# EAGLE design shield-shield (EAGLE 6.5.0)
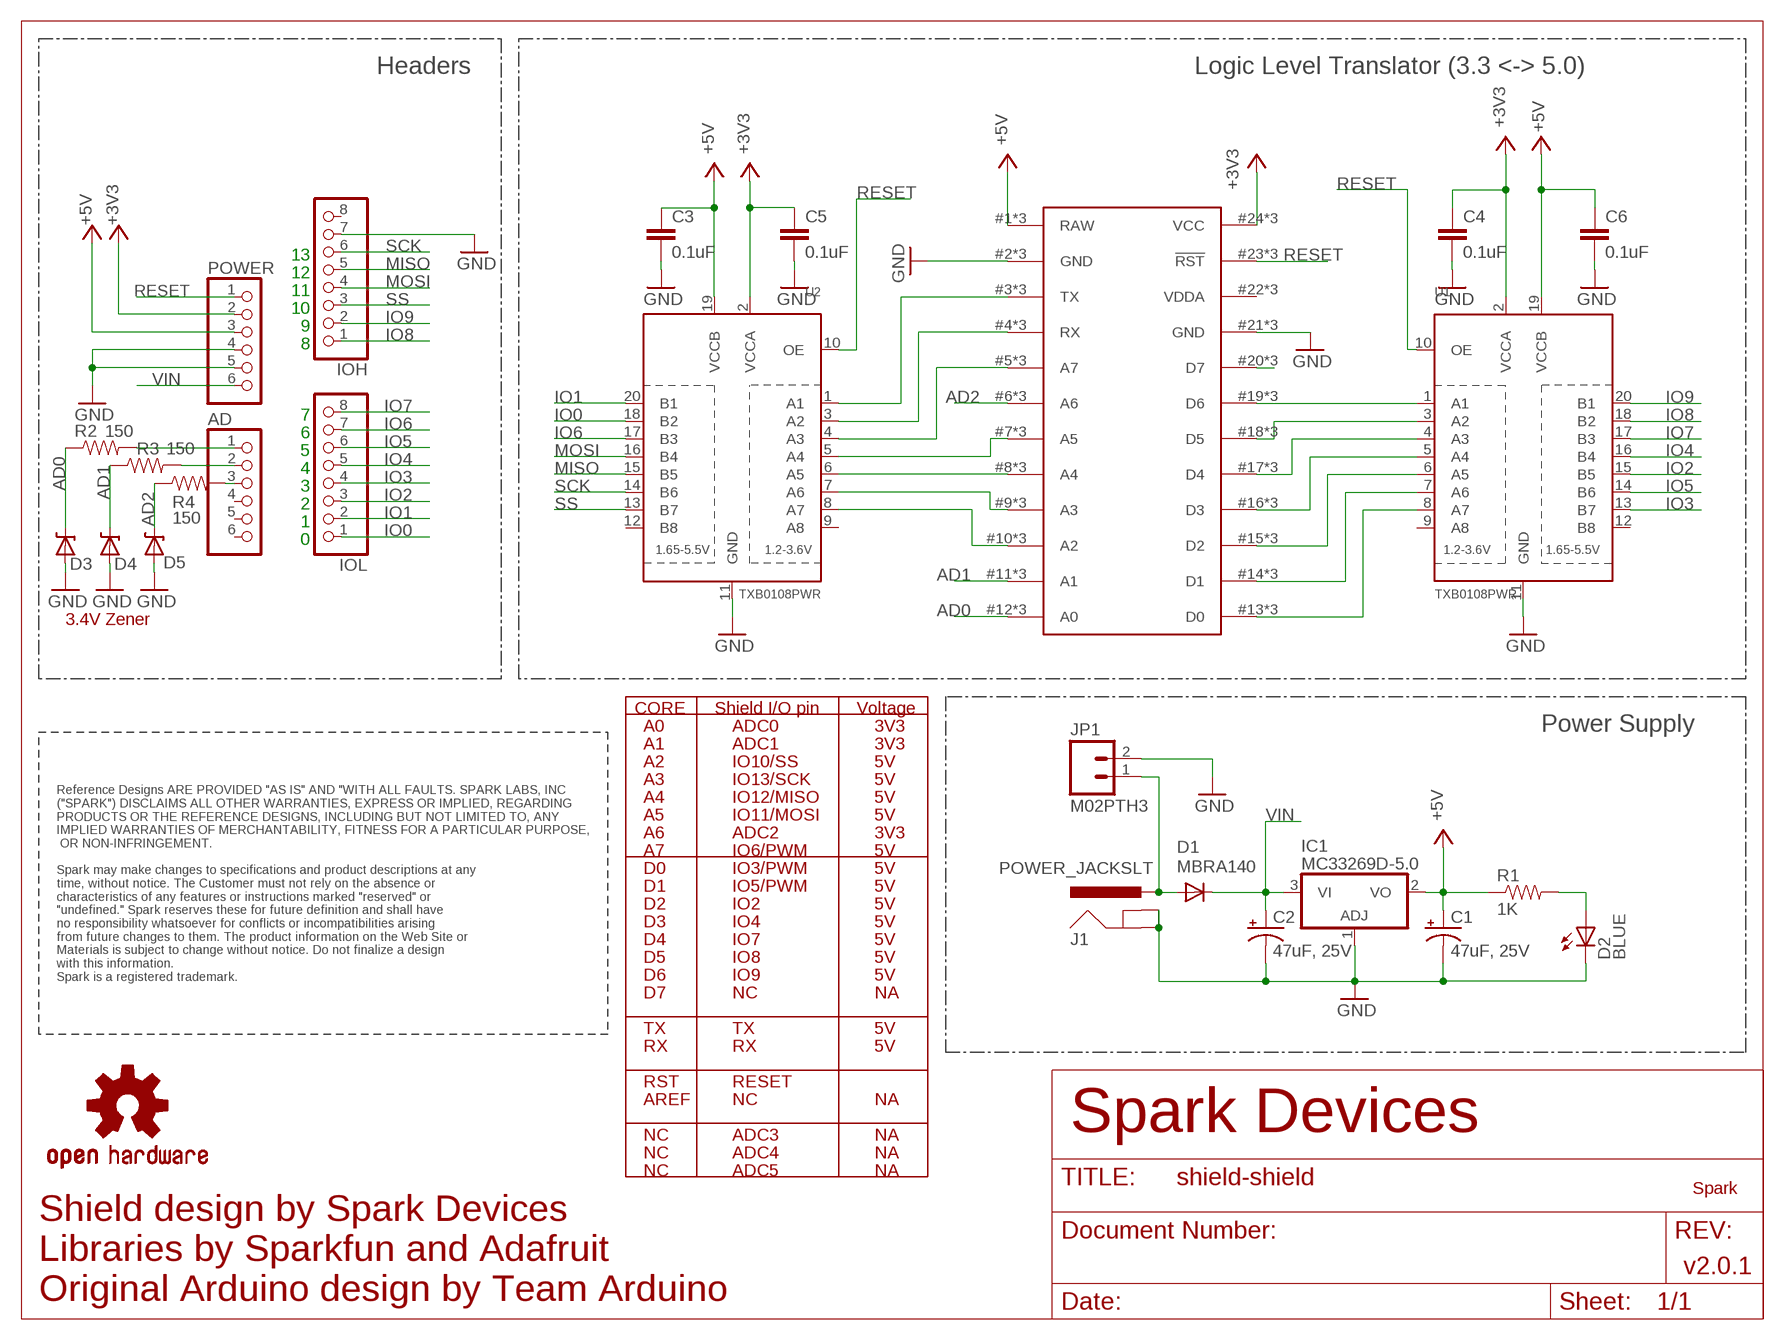
[diagram p0: schematic, sheet 1]

## Parts
AD  6 pin female header  PINHD-1X6  [1X06]
C1  47uF, 25V  CAP_POLD  [PANASONIC_D]
C2  47uF, 25V  CAP_POLD  [PANASONIC_D]
C3  0.1uF  C-EUC0603  [C0603]
C4  0.1uF  C-EUC0603  [C0603]
C5  0.1uF  C-EUC0603  [C0603]
C6  0.1uF  C-EUC0603  [C0603]
D1  MBRA140  DIODESMA  [SMA-DIODE]
D2  BLUE  LED-BLUE1206  [LED-1206]
D3  DIODE-ZENER-BZT52  [SOD-323]
D4  DIODE-ZENER-BZT52  [SOD-323]
D5  DIODE-ZENER-BZT52  [SOD-323]
IC1  MC33269D-5.0  [DPACK]
IOH  8 pin female header  PINHD-1X8  [1X08]
IOL  8 pin female header  PINHD-1X8  [1X08]
J1  POWER_JACKSLT  [POWER_JACK_SLOT]
JP1  M02PTH3  [1X02_LONGPADS]
LOGO1  OSHW-LOGOM  [OSHW-LOGO-M]
POWER  6 pin female header  PINHD-1X6  [1X06]
R1  1K  RESISTOR0603-RES  [0603-RES]
R2  150  RESISTOR0603-RES  [0603-RES]
R3  150  RESISTOR0603-RES  [0603-RES]
R4  150  RESISTOR0603-RES  [0603-RES]
U1  TXB0108PWR  [TSSOP20]
U2  TXB0108PWR  [TSSOP20]
U$1  SPARK_CORE  [SPARK_CORE_STACKABLE]
U$3  SPARK_LOGO  [SPARK_LOGO_TSTOP]

## Nets
+3V3: C4.1 C5.1 POWER.2 U1.2(VCCA) U2.2(VCCA) U$1.24(VCC) U$1.#24(VCC) U$1.@24(VCC)
+5V: C1.+ C3.1 C6.1 IC1.2(VO) POWER.3 R1.1 U1.19(VCCB) U2.19(VCCB) U$1.1(RAW) U$1.#1(RAW) U$1.@1(RAW)
A2: U2.8(A7) U$1.10(A2) U$1.#10(A2) U$1.@10(A2)
A3: U2.7(A6) U$1.9(A3) U$1.#9(A3) U$1.@9(A3)
A4: U2.6(A5) U$1.8(A4) U$1.#8(A4) U$1.@8(A4)
A5: U2.5(A4) U$1.7(A5) U$1.#7(A5) U$1.@7(A5)
A7: U2.4(A3) U$1.5(A7) U$1.#5(A7) U$1.@5(A7)
AD0: D3.1(C) R2.1 U$1.12(A0) U$1.#12(A0) U$1.@12(A0)
AD1: D4.1(C) R3.1 U$1.11(A1) U$1.#11(A1) U$1.@11(A1)
AD2: D5.1(C) R4.1 U$1.6(A6) U$1.#6(A6) U$1.@6(A6)
D7: U$1.20(D7) U$1.#20(D7) U$1.@20(D7)
GND: C1.- C2.- C3.2 C4.2 C5.2 C6.2 D2.C D3.2(A) D4.2(A) D5.2(A) IC1.1(ADJ) IOH.7 J1.GND@1(GNDBREAK) J1.GND@2(GND) JP1.2 POWER.4 POWER.5 U1.11(GND) U2.11(GND) U$1.2(GND) U$1.21(GND) U$1.#2(GND) U$1.#21(GND) U$1.@2(GND) U$1.@21(GND)
IO0: IOL.1 U2.18(B2)
IO1: IOL.2 U2.20(B1)
IO2: IOL.3 U1.15(B5)
IO3: IOL.4 U1.13(B7)
IO4: IOL.5 U1.16(B4)
IO5: IOL.6 U1.14(B6)
IO6: IOL.7 U2.17(B3)
IO7: IOL.8 U1.17(B3)
IO8: IOH.1 U1.18(B2)
IO9: IOH.2 U1.20(B1)
MISO: IOH.5 U2.15(B5)
MOSI: IOH.4 U2.16(B4)
N$1: U1.1(A1) U$1.19(D6) U$1.#19(D6) U$1.@19(D6)
N$2: U1.3(A2) U$1.18(D5) U$1.#18(D5) U$1.@18(D5)
N$3: U1.4(A3) U$1.17(D4) U$1.#17(D4) U$1.@17(D4)
N$4: U1.5(A4) U$1.16(D3) U$1.#16(D3) U$1.@16(D3)
N$5: U1.6(A5) U$1.15(D2) U$1.#15(D2) U$1.@15(D2)
N$6: U1.7(A6) U$1.14(D1) U$1.#14(D1) U$1.@14(D1)
N$7: U1.8(A7) U$1.13(D0) U$1.#13(D0) U$1.@13(D0)
N$8: D1.A J1.PWR JP1.1
N$9: D2.A R1.2
N$10: AD.1 R2.2
N$11: AD.2 R3.2
N$12: AD.3 R4.2
RESET: POWER.1 U1.10(OE) U2.10(OE) U$1.23(!RST) U$1.#23(!RST) U$1.@23(!RST)
RX: U2.3(A2) U$1.4(RX) U$1.#4(RX) U$1.@4(RX)
SCK: IOH.6 U2.14(B6)
SS: IOH.3 U2.13(B7)
TX: U2.1(A1) U$1.3(TX) U$1.#3(TX) U$1.@3(TX)
VIN: C2.+ D1.C IC1.3(VI) POWER.6
Unconnected: AD.4 AD.5 AD.6 IOH.8 U1.9(A8) U1.12(B8) U2.9(A8) U2.12(B8)

## Notes on the sheet
- Headers | Logic Level Translator (3.3 <-> 5.0)
- 13
- 12
- 11
- 10
- 9
- 8
- 7
- 6
- 5
- 4
- 3
- 2
- 1
- 0
- 3.4V Zener
- CORE | Shield I/O pin | Voltage
- A0 | ADC0 | 3V3 | Power Supply
- A1 | ADC1 | 3V3
- A2 | IO10/SS | 5V
- A3 | IO13/SCK | 5V
- A4 | IO12/MISO | 5V
- A5 | IO11/MOSI | 5V
- A6 | ADC2 | 3V3
- A7 | IO6/PWM | 5V
- D0 | IO3/PWM | 5V
- D1 | IO5/PWM | 5V
- D2 | IO2 | 5V
- D3 | IO4 | 5V
- D4 | IO7 | 5V
- D5 | IO8 | 5V
- Reference Designs ARE PROVIDED "AS IS" AND "WITH ALL FAULTS. SPARK LABS, INC 
  ("SPARK") DISCLAIMS ALL OTHER WARRANTIES, EXPRESS OR IMPLIED, REGARDING 
  PRODUCTS OR THE REFERENCE DESIGNS, INCLUDING BUT NOT LIMITED TO, ANY 
  IMPLIED WARRANTIES OF MERCHANTABILITY, FITNESS FOR A PARTICULAR PURPOSE,
   OR NON-INFRINGEMENT.
  
  Spark may make changes to specifications and product descriptions at any 
  time, without notice. The Customer must not rely on the absence or 
  characteristics of any features or instructions marked "reserved" or 
  "undefined." Spark reserves these for future definition and shall have 
  no responsibility whatsoever for conflicts or incompatibilities arising 
  from future changes to them. The product information on the Web Site or 
  Materials is subject to change without notice. Do not finalize a design 
  with this information. 
  Spark is a registered trademark.
- D6 | IO9 | 5V
- D7 | NC | NA
- TX | TX | 5V
- RX | RX | 5V
- RST | RESET
- AREF | NC | NA
- Spark Devices
- NC | ADC3 | NA
- NC | ADC4 | NA
- NC | ADC5 | NA
- v2.0.1
- Shield design by Spark Devices
  Libraries by Sparkfun and Adafruit
  Original Arduino design by Team Arduino

## Power pins joined to a net without a drawn wire
VDDA: U$1.22(VDDA) U$1.#22(VDDA) U$1.@22(VDDA)

## Library data of the parts
AD POWER = pinhead:PINHD-1X6: PIN HEADER
C1 C2 = SparkFun-Capacitors:CAP_POL: Capacitor Polarized These are standard SMD and PTH capacitors. Normally 10uF, 47uF, and 100uF in electrolytic and tantalum varieties. Always verify the external diameter of the through hole cap, it varies with capacity, voltage, and manufacturer. The EIA devices should be standard.
C3-C6 = rcl:C-EU: CAPACITOR, European symbol
D1 = SparkFun-DiscreteSemi:DIODE: Diode These are standard reverse protection diodes and small signal diodes. SMA package can handle up to about 1A. SOD-323 can handle about 200mA. What the SOD-323 package when ordering, there are some mfgs out there that are 5-pin packages.
D2 = SparkFun-LED:LED-BLUE: Blue LEDs for production use Various blue LEDs stocked by SparkFun production 0603 - DIO-08575 Rebel - DIO-09553 1206 - DIO-09911; PROD_ID: DIO-09911
D3-D5 = SparkFun-DiscreteSemi:DIODE-ZENER: Zener Diode Production Part - 8199 3.4V Zener Voltage
IC1 = linear:MC33269?*: Adjustable Output Low Dropout Voltage Regulator 800 mA Source: http://www.onsemi.com/pub/Collateral/MC33269-D.PDF
IOH IOL = pinhead:PINHD-1X8: PIN HEADER
J1 = Spark:POWER_JACK: Power Jack This is the standard 5.5mm barrel jack for power. The PTH is the most common, proven, reliable, footprint. The Slot footprint only works if the mill layer is transmitted to the PCB fab house so be warned. Spark Fun Electronics SKU : PRT-00119 SMT: CONN-08106 Mating wall wart : TOL-00298 (and others)
JP1 = SparkFun-Connectors:M02: Standard 2-pin 0.1" header. Use with - straight break away headers ( PRT-00116) - right angle break away headers (PRT-00553) - swiss pins (PRT-00743) - machine pins (PRT-00117) - female headers (PRT-00115) Molex polarized connector foot print use with: PRT-08233 with associated crimp pins and housings. 2.54_SCREWTERM for use with PRT-10571. 3.5mm Screw Terminal footprints for PRT-08084 5mm Screw Terminal footprints for use with PRT-08433
LOGO1 = Spark:OSHW-LOGO: Open Source Hardware Logo This logo indicates the piece of hardware it is found on incorporates a OSHW license and/or adheres to the definition of open source hardware found here: http://freedomdefined.org/OSHW
R1-R4 = SparkFun-Passives:RESISTOR: Resistor Basic schematic elements and footprints for 0603, 1206, and PTH resistors.
U1 U2 = adafruit:TXB0108PWR: 8-Bit Bi-Directional Level Shifter 1.2V-3.6V (VCCA) to 1.65V-5.5V (VCCB) bi-directional level shifter with auto direction sensing. Max data rate - VCCA 1.8V: 20Mbps (50ns), VCCA 3.3V: 100Mbps (10ns) Digikey: 296-21527-1-ND
U$1 = Spark:SPARK_CORE
U$3 = Spark:SPARK_LOGO

## Net classes
0 default: width 0.152 mm, drill 0.305 mm, clearance 0.152 mm

## Board
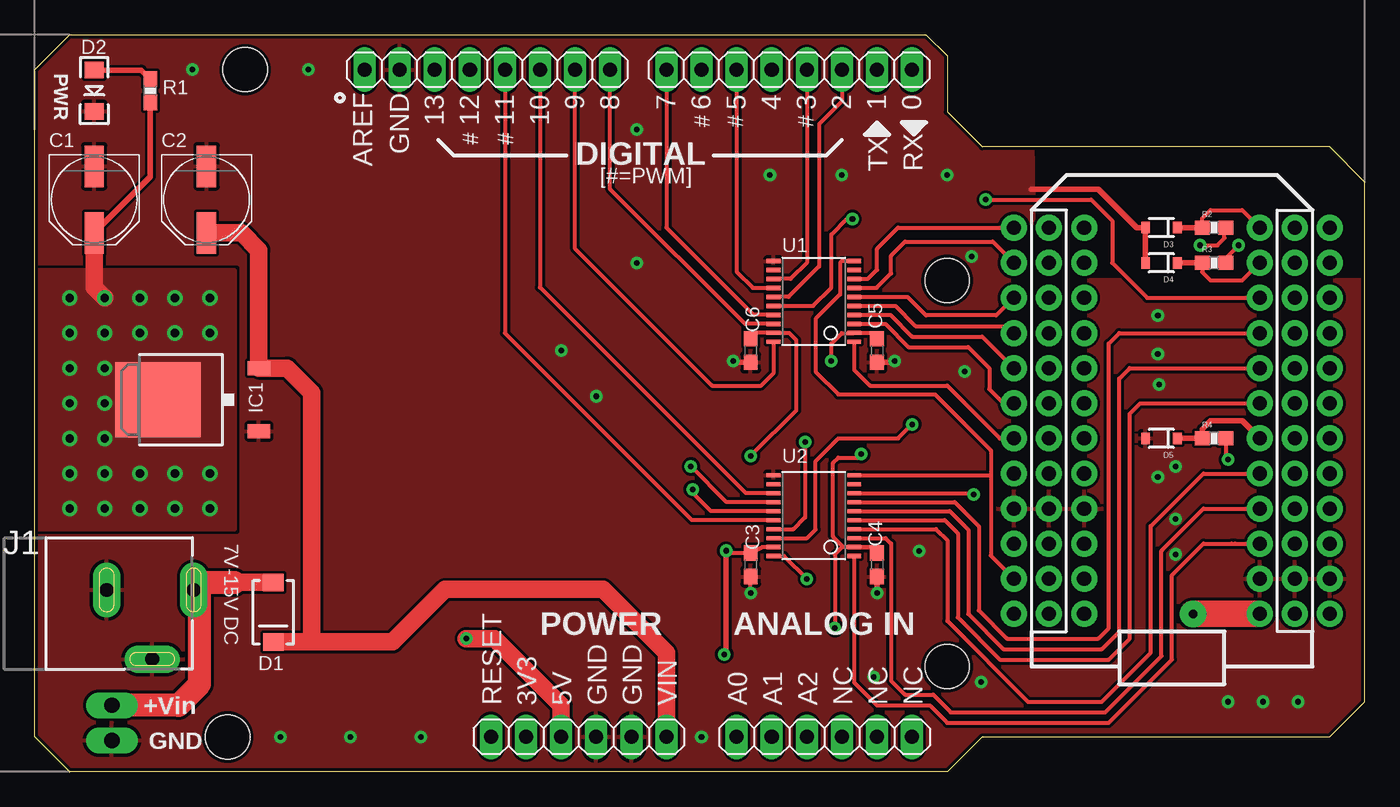
[diagram p1: board, top side]
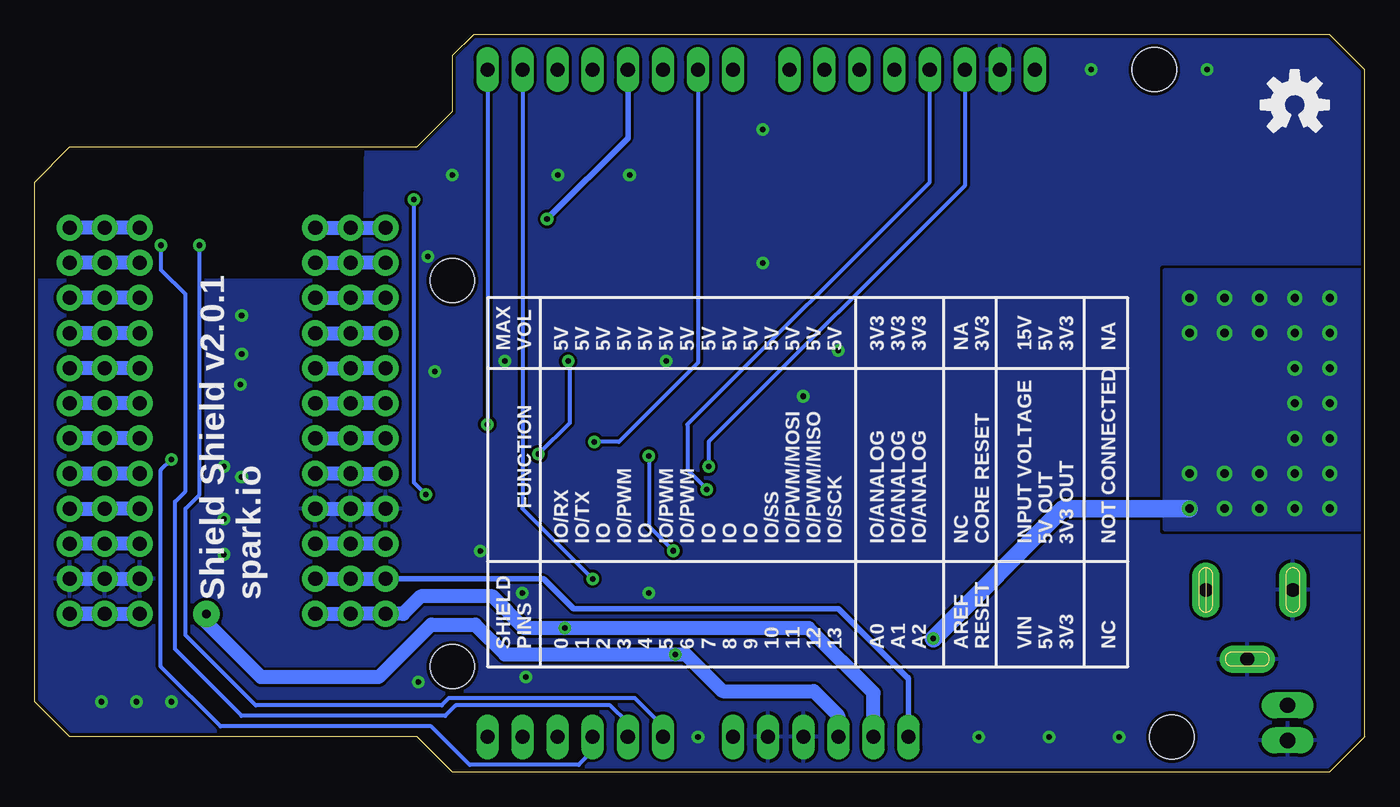
[diagram p2: board, bottom side, seen from below]

Size 96.27 x 53.34 mm. Coordinates in mm from the lower left corner, seen from the top.
Outline: 2.54,53.34 64.52,53.34 66.04,51.82 66.04,47.75 68.58,45.21 93.73,45.21 96.27,42.67 96.27,5.08 93.73,2.54 68.58,2.54 66.04,0 2.54,0 0,2.54 0,50.8 2.54,53.34
Copper layers (1*16): Top 0.035mm / dielectric 1.5mm / Bottom 0.035mm
Design rules "SparkFun": minimum track width 8mil, minimum drill 20mil, track to track 8mil, track to pad 8mil, pad to pad 8mil, via to via 8mil, smd to smd 8mil, copper to edge 10mil, drill to drill 8mil, minimum pad ring 12mil, minimum via ring 10mil, stop-mask expansion 4mil, vias tented up to drill 25mil, thermal gap 10mil
Holes 3.2 mm at 66.04,35.56 66.04,7.62 15.24,50.8 13.97,2.54
vRestrict: area 47.9,10.3 to 48.5,10.8; area 50.4,10.2 to 50.9,11

### Footprints (pad centres in the part's own frame; a part is rotated, then mirrored left to right if it is on the bottom)
1X06 = drill 1.016 long: 1 -6.35,0; 2 -3.81,0; 3 -1.27,0; 4 1.27,0; 5 3.81,0; 6 6.35,0
PANASONIC_D = smd 3 x 1.4: + 2.4,0; - -2.4,0
C0603 = smd 1.1 x 1: 1 -0.85,0; 2 0.85,0
SMA-DIODE = smd 1.27 x 1.47: A -2.15,0; C 2.15,0
LED-1206 = smd 1.2 x 1.4: A -1.5,0; C 1.5,0
SOD-323 = smd 0.63 x 0.83: 1 -1.15,0; 2 1.15,0
DPACK = smd 1 x 1.6: 1 -2.28,-4.8; 3 2.28,-4.8 | smd 5.4 x 6.2: 2 0,2.5
1X08 = drill 1.016 long: 1 -8.89,0; 2 -6.35,0; 3 -3.81,0; 4 -1.27,0; 5 1.27,0; 6 3.81,0; 7 6.35,0; 8 8.89,0
POWER_JACK_SLOT = drill 1 pad 2 long: GND@1 2.58,7.5; GND@2 7.58,10.8; PWR 2.58,13.8
1X02_LONGPADS = drill 1.118 pad 1.88 long: 1 0,0; 2 2.54,0
0603-RES = smd 1.1 x 1: 1 -0.85,0; 2 0.85,0
TSSOP20 = smd 0.305 x 0.991: 1 -2.925,-2.918; 2 -2.275,-2.918; 3 -1.625,-2.918; 4 -0.975,-2.918; 5 -0.325,-2.918; 6 0.325,-2.918; 7 0.975,-2.918; 8 1.625,-2.918; 9 2.275,-2.918; 10 2.925,-2.918; 11 2.925,2.918; 12 2.275,2.918; 13 1.625,2.918; 14 0.975,2.918; 15 0.325,2.918; 16 -0.325,2.918; 17 -0.975,2.918; 18 -1.625,2.918; 19 -2.275,2.918; 20 -2.925,2.918
SPARK_CORE_STACKABLE = drill 1.016 pad 1.88: 1 -8.89,13.97; 2 -8.89,11.43; 3 -8.89,8.89; 4 -8.89,6.35; 5 -8.89,3.81; 6 -8.89,1.27; 7 -8.89,-1.27; 8 -8.89,-3.81; 9 -8.89,-6.35; 10 -8.89,-8.89; 11 -8.89,-11.43; 12 -8.89,-13.97; 13 8.89,-13.97; 14 8.89,-11.43; 15 8.89,-8.89; 16 8.89,-6.35; 17 8.89,-3.81; 18 8.89,-1.27; 19 8.89,1.27; 20 8.89,3.81; 21 8.89,6.35; 22 8.89,8.89; 23 8.89,11.43; 24 8.89,13.97; #1 -6.35,13.97; #2 -6.35,11.43; #3 -6.35,8.89; #4 -6.35,6.35; #5 -6.35,3.81; #6 -6.35,1.27; #7 -6.35,-1.27; #8 -6.35,-3.81; #9 -6.35,-6.35; #10 -6.35,-8.89; #11 -6.35,-11.43; #12 -6.35,-13.97; #13 11.43,-13.97; #14 11.43,-11.43; #15 11.43,-8.89; #16 11.43,-6.35; #17 11.43,-3.81; #18 11.43,-1.27; #19 11.43,1.27; #20 11.43,3.81; #21 11.43,6.35; #22 11.43,8.89; #23 11.43,11.43; #24 11.43,13.97; @1 -11.43,13.97; @2 -11.43,11.43; @3 -11.43,8.89; @4 -11.43,6.35; @5 -11.43,3.81; @6 -11.43,1.27; @7 -11.43,-1.27; @8 -11.43,-3.81; @9 -11.43,-6.35; @10 -11.43,-8.89; @11 -11.43,-11.43; @12 -11.43,-13.97; @13 6.35,-13.97; @14 6.35,-11.43; @15 6.35,-8.89; @16 6.35,-6.35; @17 6.35,-3.81; @18 6.35,-1.27; @19 6.35,1.27; @20 6.35,3.81; @21 6.35,6.35; @22 6.35,8.89; @23 6.35,11.43; @24 6.35,13.97

### Placement (x,y rotation side)
AD  57.15,2.54 0 top
C1  4.32,41.4 270 top
C2  12.45,41.4 270 top
C3  51.82,14.99 270 top
C4  60.96,14.99 270 top
C5  60.96,30.48 270 top
C6  51.82,30.48 270 top
D1  17.27,11.56 270 top
D2  4.32,49.28 270 top
D3  81.53,39.37 180 top
D4  81.53,36.83 180 top
D5  81.53,24.13 180 top
IC1  11.43,26.92 90 top
IOH  32.77,50.8 180 top
IOL  54.61,50.8 180 top
J1  -2.29,15.75 270 top
JP1  5.59,4.83 270 top
LOGO1  5.08,48.26 0 bottom
POWER  39.37,2.54 0 top
R1  8.38,49.28 90 top
R2  85.34,39.37 0 top
R3  85.34,36.83 0 top
R4  85.34,24.13 0 top
U1  56.39,34.04 90 top
U2  56.39,18.54 90 top
U$1  82.3,25.4 180 top
U$3  30.48,26.67 0 top

### Tracks (layer width: path | path; a pad name or v marks a point on that pad's centre or on a via)
+3V3  (via drill 0.4)
  Top 0.305: C5.1 60.53,31.76 U1.2 59.3,31.75 58.42,31.75 57.66,30.99 v57.66,29.72 | v59.82,22.99 59.56,22.73 58.17,22.73 57.78,22.35 57.78,17.02 58.54,16.27 U2.2 60.53,16.27 C4.1 60.87,15.84 60.45,16.26 58.42,16.26 57.91,15.75 v57.91,10.41
  Bottom 0.305: v57.66,29.72 57.53,29.59 57.53,25.27 v59.82,22.99
  Bottom 1.016: U$1.@24 U$1.24 U$1.#24 69.6,11.43 68.33,12.7 63.12,12.7 60.83,10.41 v57.91,10.41 40.26,10.41 35.56,5.71 POWER.2
+5V  (via drill 0.4, 0.6, 0.6 pad 1.93)
  Top 0.305: v51.82,22.86 55.12,26.16 55.12,31.24 54.61,31.75 53.48,31.75 U1.19 52.25,31.76 C6.1 | U2.19 52.66,16.27 C3.1 50.2,15.84 v50.04,16
  Top 0.406: v50.04,16 50.04,8.64 v49.91,8.51 | R1.1 8.38,43.07 C1.+
  Top 1.27: C1.+ 4.32,35.05 v5.08,34.29 | v31.24,9.65 33.27,9.65 38.1,4.83 POWER.3
  Top 1.93: v83.82,11.43 U$1.#1
  Bottom 0.305: v51.82,22.86 51.82,17.78 v50.04,16
  Bottom 1.016: U$1.1 U$1.@1 U$1.#1 | POWER.3 38.1,4.06 39.88,5.84 46.48,5.84 49.15,8.51 v49.91,8.51 62.23,8.51 64.39,10.67 67.56,10.67 71.37,6.86 79.88,6.86 83.82,10.79 v83.82,11.43
  Bottom 1.27: v12.7,19.05 21.84,19.05 v31.24,9.65
  other vias: 2.54,19.05 5.08,19.05 7.62,19.05 10.16,19.05 12.7,21.59 10.16,21.59 7.62,21.59 5.08,21.59 2.54,21.59 2.54,24.13 2.54,26.67 2.54,29.21 2.54,31.75 2.54,34.29 7.62,34.29 10.16,34.29 12.7,34.29 12.7,31.75 10.16,31.75 7.62,31.75 5.08,31.75 5.08,29.21 5.08,26.67 5.08,24.13
  pour Top (no thermals): -1.24,17.53 -1.24,36.32 14.48,36.32 14.48,17.53
  pour Bottom: -1.24,17.53 14.48,17.53 14.48,36.32 -1.24,36.32
A2  (via drill 0.4)
  Top 0.305: U2.8 67.84,20.17 arc-90 v67.94,20.07 | v68.83,41.4 76.45,41.4 77.98,39.88 77.98,36.83 80.52,34.29 U$1.#10
  Bottom 0.305: v68.83,41.4 68.83,20.95 v67.94,20.07
  Bottom 1.016: U$1.@10 U$1.10 U$1.#10
A3
  Top 0.305: U2.7 66.59,19.52 68.33,17.78 68.33,11.68 70.36,9.65 76.96,9.65 77.72,10.41 77.72,30.99 78.49,31.75 U$1.#9
  Bottom 1.016: U$1.@9 U$1.9 U$1.#9
A4
  Top 0.305: U2.6 66.22,18.87 67.56,17.53 67.56,11.43 70.1,8.89 77.22,8.89 78.49,10.16 78.49,28.45 79.25,29.21 U$1.#8
  Bottom 1.016: U$1.@8 U$1.8 U$1.#8
A5
  Top 0.305: U2.5 65.86,18.22 66.8,17.27 66.8,11.18 69.85,8.13 77.72,8.13 79.25,9.65 79.25,25.91 80.01,26.67 U$1.#7
  Bottom 1.016: U$1.@7 U$1.7 U$1.#7
A7
  Top 0.305: U2.4 65.24,17.57 66.04,16.76 66.04,10.92 71.88,5.08 77.22,5.08 80.77,8.64 80.77,17.78 84.58,21.59 U$1.#5
  Bottom 1.016: U$1.@5 U$1.5 U$1.#5
AD0
  Top 0.305: R2.1 84.49,40.04 85.09,40.64 87.38,40.64 U$1.#12
  Top 0.406: D3.1 R2.1
  Bottom 1.016: U$1.@12 U$1.12 U$1.#12
AD1
  Top 0.305: R3.1 84.49,36.16 85.09,35.56 87.38,35.56 U$1.#11
  Top 0.406: D4.1 R3.1
  Bottom 0.305: U$1.@11 90.68,36.83
  Bottom 1.016: U$1.11 U$1.@11 | U$1.#11 90.68,36.83
AD2
  Top 0.406: D5.1 R4.1 84.49,24.8 85.09,25.4 87.38,25.4 U$1.#6
  Bottom 1.016: U$1.@6 U$1.6 U$1.#6
D7
  Bottom 1.016: U$1.@20 U$1.20 U$1.#20
GND  (via drill 0.4)
  Top 0.305: v51.82,12.95 C3.2
  Top 0.406: C4.2 v60.96,12.95 | C6.2 50.55,29.63 v50.55,29.72 | C5.2 62.23,29.63 v62.23,29.72 | 72.14,42.16 76.96,42.16 79.76,39.37 D3.2 D4.2
  Bottom 1.016: U$1.@2 U$1.2 U$1.#2 | U$1.@21 U$1.21 U$1.#21
  other vias: 43.56,36.83 81.28,33.02 66.04,43.18 58.42,43.18 53.21,43.18 88.9,5.08 40.64,27.18 43.56,46.48 17.78,2.54 22.86,2.54 27.94,2.54 91.44,5.08 86.36,5.08 81.28,30.23 38.1,30.48 67.31,28.96 19.81,50.8 11.43,50.8 48.26,2.54 64,16 81.37,28.03 68.5,6.5 67.8,37.3 60.71,6.86 81.28,21.34 82.55,15.75 82.55,22.1 82.55,18.29
  pour Bottom (rank 2): -0.25,-0.25 96.77,-0.25 96.77,35.56 72.39,35.56 72.14,53.59 -0.25,53.59
  pour Top (rank 3): -0.25,-0.25 96.77,-0.25 96.77,35.56 72.39,35.56 72.14,53.59 -0.25,53.59
IO0  (via drill 0.4)
  Top 0.305: U2.18 55.91,16.92 56.52,17.53 56.52,22.48 58.17,24.13 62.48,24.13 v63.5,25.15
  Bottom 0.305: IOL.1 v63.5,25.15
IO1  (via drill 0.4)
  Top 0.305: U2.20 54.23,15.62 v55.88,13.97
  Bottom 0.305: IOL.2 60.96,19.05 v55.88,13.97
IO2
  Top 0.305: IOL.3 58.42,48.51 56.77,46.86 56.77,36.58 54.55,34.36 U1.15
IO3
  Top 0.305: IOL.4 55.88,36.83 54.71,35.66 U1.13
IO4  (via drill 0.4)
  Top 0.305: U1.16 56.33,33.71 57.66,35.04 57.66,38.86 58.8,40.01 v59.18,40.01
  Bottom 0.406: IOL.5 53.34,45.85 v59.18,40.01
IO5
  Top 0.305: IOL.6 50.8,36.2 51.98,35.01 U1.14
IO6  (via drill 0.4)
  Top 0.305: v55.75,23.88 55.75,18.41 54.91,17.57 U2.17
  Bottom 0.305: IOL.7 48.26,29.59 53.98,23.88 v55.75,23.88
IO7
  Top 0.305: U1.17 52.03,33.06 45.72,39.37 IOL.8
IO8
  Top 0.305: IOH.1 41.66,42.16 51.41,32.41 U1.18
IO9
  Top 0.305: U1.20 53.47,28.83 52.58,27.94 49.02,27.94 39.12,37.85 IOH.2
MISO  (via drill 0.4)
  Top 0.305: U2.15 48.95,18.87 47.62,20.19 v47.62,20.45
  Bottom 0.305: IOH.5 31.5,42.67 49.02,25.15 49.02,21.84 v47.62,20.45
MOSI
  Top 0.305: U2.16 47.57,18.22 34.04,31.75 IOH.4
N$1
  Top 0.305: U1.1 59.31,29.09 60.45,27.94 66.04,27.94 69.85,24.13 U$1.#19
  Bottom 1.016: U$1.@19 U$1.19 U$1.#19
N$2
  Top 0.305: U1.3 61.57,32.41 63.25,30.73 67.56,30.73 69.09,29.21 69.09,27.69 70.1,26.67 U$1.#18
  Bottom 1.016: U$1.@18 U$1.18 U$1.#18
N$3
  Top 0.305: U1.4 61.94,33.06 63.5,31.5 68.58,31.5 U$1.#17
  Bottom 1.016: U$1.@17 U$1.17 U$1.#17
N$4
  Top 0.305: U1.5 62.3,33.71 63.75,32.26 70.36,32.26 U$1.#16
  Bottom 1.016: U$1.@16 U$1.16 U$1.#16
N$5
  Top 0.305: U1.6 63.17,34.36 64.52,33.02 69.6,33.02 U$1.#15
  Bottom 1.016: U$1.@15 U$1.15 U$1.#15
N$6
  Top 0.305: U1.7 60.92,35.01 61.98,36.07 61.98,37.34 62.99,38.35 69.34,38.35 U$1.#14
  Bottom 1.016: U$1.@14 U$1.14 U$1.#14
N$7
  Top 0.305: U1.8 60.3,35.66 60.96,36.32 60.96,37.85 62.48,39.37 U$1.#13
  Bottom 1.016: U$1.@13 U$1.13 U$1.#13
N$8
  Top 1.27: 14.48,13.72 14.49,13.71 D1.A
  Top 1.676: JP1.1 10.41,4.83 11.94,6.35 11.94,12.74 J1.PWR 12.06,13.72 14.48,13.72
N$9
  Top 0.406: D2.A 7.73,50.78 R1.2
N$10  (via drill 0.4)
  Top 0.305: v84.33,38.1 85.6,38.1 86.11,38.61 86.11,39.28 R2.2
  Bottom 0.305: AD.1 50.8,3.3 52.83,5.33 66.29,5.33 66.8,4.83 80.26,4.83 85.34,9.91 85.34,19.05 84.33,20.07 v84.33,38.1
N$11  (via drill 0.4)
  Top 0.305: R3.2 86.19,37.17 v87.12,38.1
  Bottom 0.305: AD.2 53.34,3.56 54.61,4.83 65.79,4.83 66.55,4.06 81.28,4.06 86.11,8.89 86.11,19.56 85.34,20.32 85.34,34.54 87.12,36.32 v87.12,38.1
N$12  (via drill 0.4)
  Top 0.305: R4.2 86.19,22.77 v86.36,22.61
  Bottom 0.305: AD.3 55.88,1.52 56.9,0.51 64.77,0.51 67.56,3.3 82.8,3.3 87.12,7.62 87.12,21.84 v86.36,22.61
RESET
  Top 0.305: U1.10 58.42,36.96 58.29,36.83 58.29,34.54 56.52,32.77 56.52,28.96 58.17,27.3 65.15,27.3 69.19,23.27 69.19,21.46 | 69.19,21.46 69.19,15.65 U$1.#23 | U2.10 69.19,21.46
  Bottom 0.305: 33.02,6.86 33.02,6.73
  Bottom 0.406: U$1.#23 59.44,13.97 57.28,11.81 38.1,11.81 33.02,6.73 POWER.1
  Bottom 1.016: U$1.@23 U$1.23 U$1.#23
RX
  Top 0.305: U2.3 61.57,16.92 61.98,16.51 61.98,6.6 62.99,5.59 65.02,5.59 66.29,4.32 77.47,4.32 81.53,8.38 81.53,16 84.58,19.05 U$1.#4
  Bottom 1.016: U$1.@4 U$1.4 U$1.#4
SCK  (via drill 0.4)
  Top 0.305: U2.14 50.08,19.52 v47.5,22.1
  Bottom 0.305: IOH.6 28.96,42.42 47.5,23.88 v47.5,22.1
SS
  Top 0.305: U2.13 51.46,20.17 36.58,35.05 IOH.3
TX
  Top 0.305: U2.1 59.31,6.48 60.96,4.83 64.77,4.83 66.04,3.56 77.72,3.56 82.3,8.13 82.3,14.22 84.58,16.51 86.61,16.51 86.87,16.51 U$1.#3
  Bottom 1.016: U$1.@3 U$1.3 U$1.#3
VDDA
  Bottom 1.016: U$1.#22 U$1.22 U$1.@22
VIN
  Top 1.27: 20.07,9.41 20.07,27.43 18.29,29.2 IC1.3 16.23,37.74 14.99,38.99 12.46,38.99 C2.+ | D1.C 20.07,9.41 | 20.07,9.41 25.92,9.41 29.72,13.21 41.15,13.21 45.72,8.64 POWER.6

### Text on the board
tPlace: PWR | AREF | GND | 13 | 12 | 11 | 10 | 9 | 8 | 7 | 6 | 5 | 4 | 3 | 2 | 1 | 0 | # | # | # | # | # | DIGITAL | [#=PWM] | TX | RX | 7V-15V DC | ANALOG IN | RESET | 3V3 | 5V | GND | GND | VIN | A0 | A1 | A2 | NC | NC | NC | +Vin | GND
bPlace: 5V / 5V / 5V / 5V / 5V / 5V / 5V / 5V / 5V / 5V / 5V / 5V / 5V / 5V / / 3V3 / 3V3 / 3V3 / / NA / 3V3 / / 15V / 5V / 3V3 / / NA | MAX / VOL | FUNCTION | IO/RX / IO/TX / IO / IO/PWM / IO / IO/PWM / IO/PWM / IO / IO / IO / IO/SS / IO/PWM/MOSI / IO/PWM/MISO / IO/SCK / / IO/ANALOG / IO/ANALOG / IO/ANALOG / / NC / CORE RESET / / INPUT VOLTAGE / 5V OUT / 3V3 OUT / / NOT CONNECTED | Shield Shield v2.0.1 / spark.io | 0 / 1 / 2 / 3 / 4 / 5 / 6 / 7 / 8 / 9 / 10 / 11 / 12 / 13 / / A0 / A1 / A2 / / AREF / RESET / / VIN / 5V / 3V3 / / NC | SHIELD / PINS
tDocu: Reference Designs ARE PROVIDED "AS IS" AND "WITH ALL FAULTS. SPARK LABS, INC / ("SPARK") DISCLAIMS ALL OTHER WARRANTIES, EXPRESS OR IMPLIED, REGARDING / PRODUCTS OR THE REFERENCE DESIGNS, INCLUDING BUT NOT LIMITED TO, ANY / IMPLIED WARRANTIES OF MERCHANTABILITY, FITNESS FOR A PARTICULAR PURPOSE, / OR NON-INFRINGEMENT. / / Spark may make changes to specifications and product descriptions at any / time, without notice. The Customer must not rely on the absence or / characteristics of any features or instructions marked "reserved" or / "undefined." Spark reserves these for future definition and shall have / no responsibility whatsoever for conflicts or incompatibilities arising / from future changes to them. The product information on the Web Site or / Materials is subject to change without notice. Do not finalize a design / with this information. / Spark is a registered trademark.
_tsilk: CORE | Shield I/O pin | Voltage | CORE | CORE | Shield I/O pin | Shield I/O pin | Voltage | Voltage | A0 | ADC0 | 3V3 | A1 | A0 | A0 | ADC1 | ADC0 | ADC0 | 3V3 | 3V3 | 3V3 | A1 | ADC1 | 3V3 | A2 | A1 | IO10/SS | ADC1 | 5V | 3V3 | A3 | A2 | A2 | IO13/SCK | IO10/SS | IO10/SS | 5V | 5V | 5V | A3 | IO13/SCK | 5V | A4 | A3 | IO12/MISO | IO13/SCK | 5V | 5V | A5 | A4 | A4 | IO11/MOSI | IO12/MISO | IO12/MISO | 5V | 5V | 5V | A5 | IO11/MOSI | 5V | A6 | A5 | ADC2 | IO11/MOSI | 3V3 | 5V | A7 | A6 | A6 | IO6/PWM | ADC2 | ADC2 | 5V | 3V3 | 3V3 | D0 | A7 | A7 | IO3/PWM | IO6/PWM | IO6/PWM | 5V | 5V | 5V | D0 | D0 | IO3/PWM | IO3/PWM | 5V | 5V | D1 | IO5/PWM | 5V | D2 | D1 | D1 | IO2 | IO5/PWM | IO5/PWM | 5V | 5V | 5V | D2 | D2 | IO2 | IO2 | 5V | 5V | D3 | IO4 | 5V | D4 | D3 | D3 | IO7 | IO4 | IO4 | 5V | 5V | 5V | D4 | D4 | IO7 | IO7 | 5V | 5V | D5 | IO8 | 5V | D6 | D5 | D5 | IO9 | IO8 | IO8 | 5V | 5V | 5V | D6 | IO9 | 5V | D7 | D6 | NC | IO9 | NA | 5V | D7 | D7 | NC | NC | NA | NA | TX | TX | 5V | RX | TX | TX | RX | TX | TX | 5V | 5V | 5V | RX | RX | 5V | RX | RX | 5V | RST | RESET | AREF | RST | RST | NC | RESET | RESET | NA | AREF | AREF | NC | NC | NA | NA | NC | ADC3 | NA | NC | NC | ADC3 | ADC3 | NA | NA | NC | ADC4 | NA | NC | NC | NC | ADC5 | ADC4 | ADC4 | NA | NA | NA | NC | NC | ADC5 | ADC5 | NA | NA
214bmp: D:/SmartProjects/Snc/a4_bn_logo2.bmp